# Altium schematic sheet 19-AM64x-08.SchDoc
size B; SheetNumber: 19; SheetTotal: 25
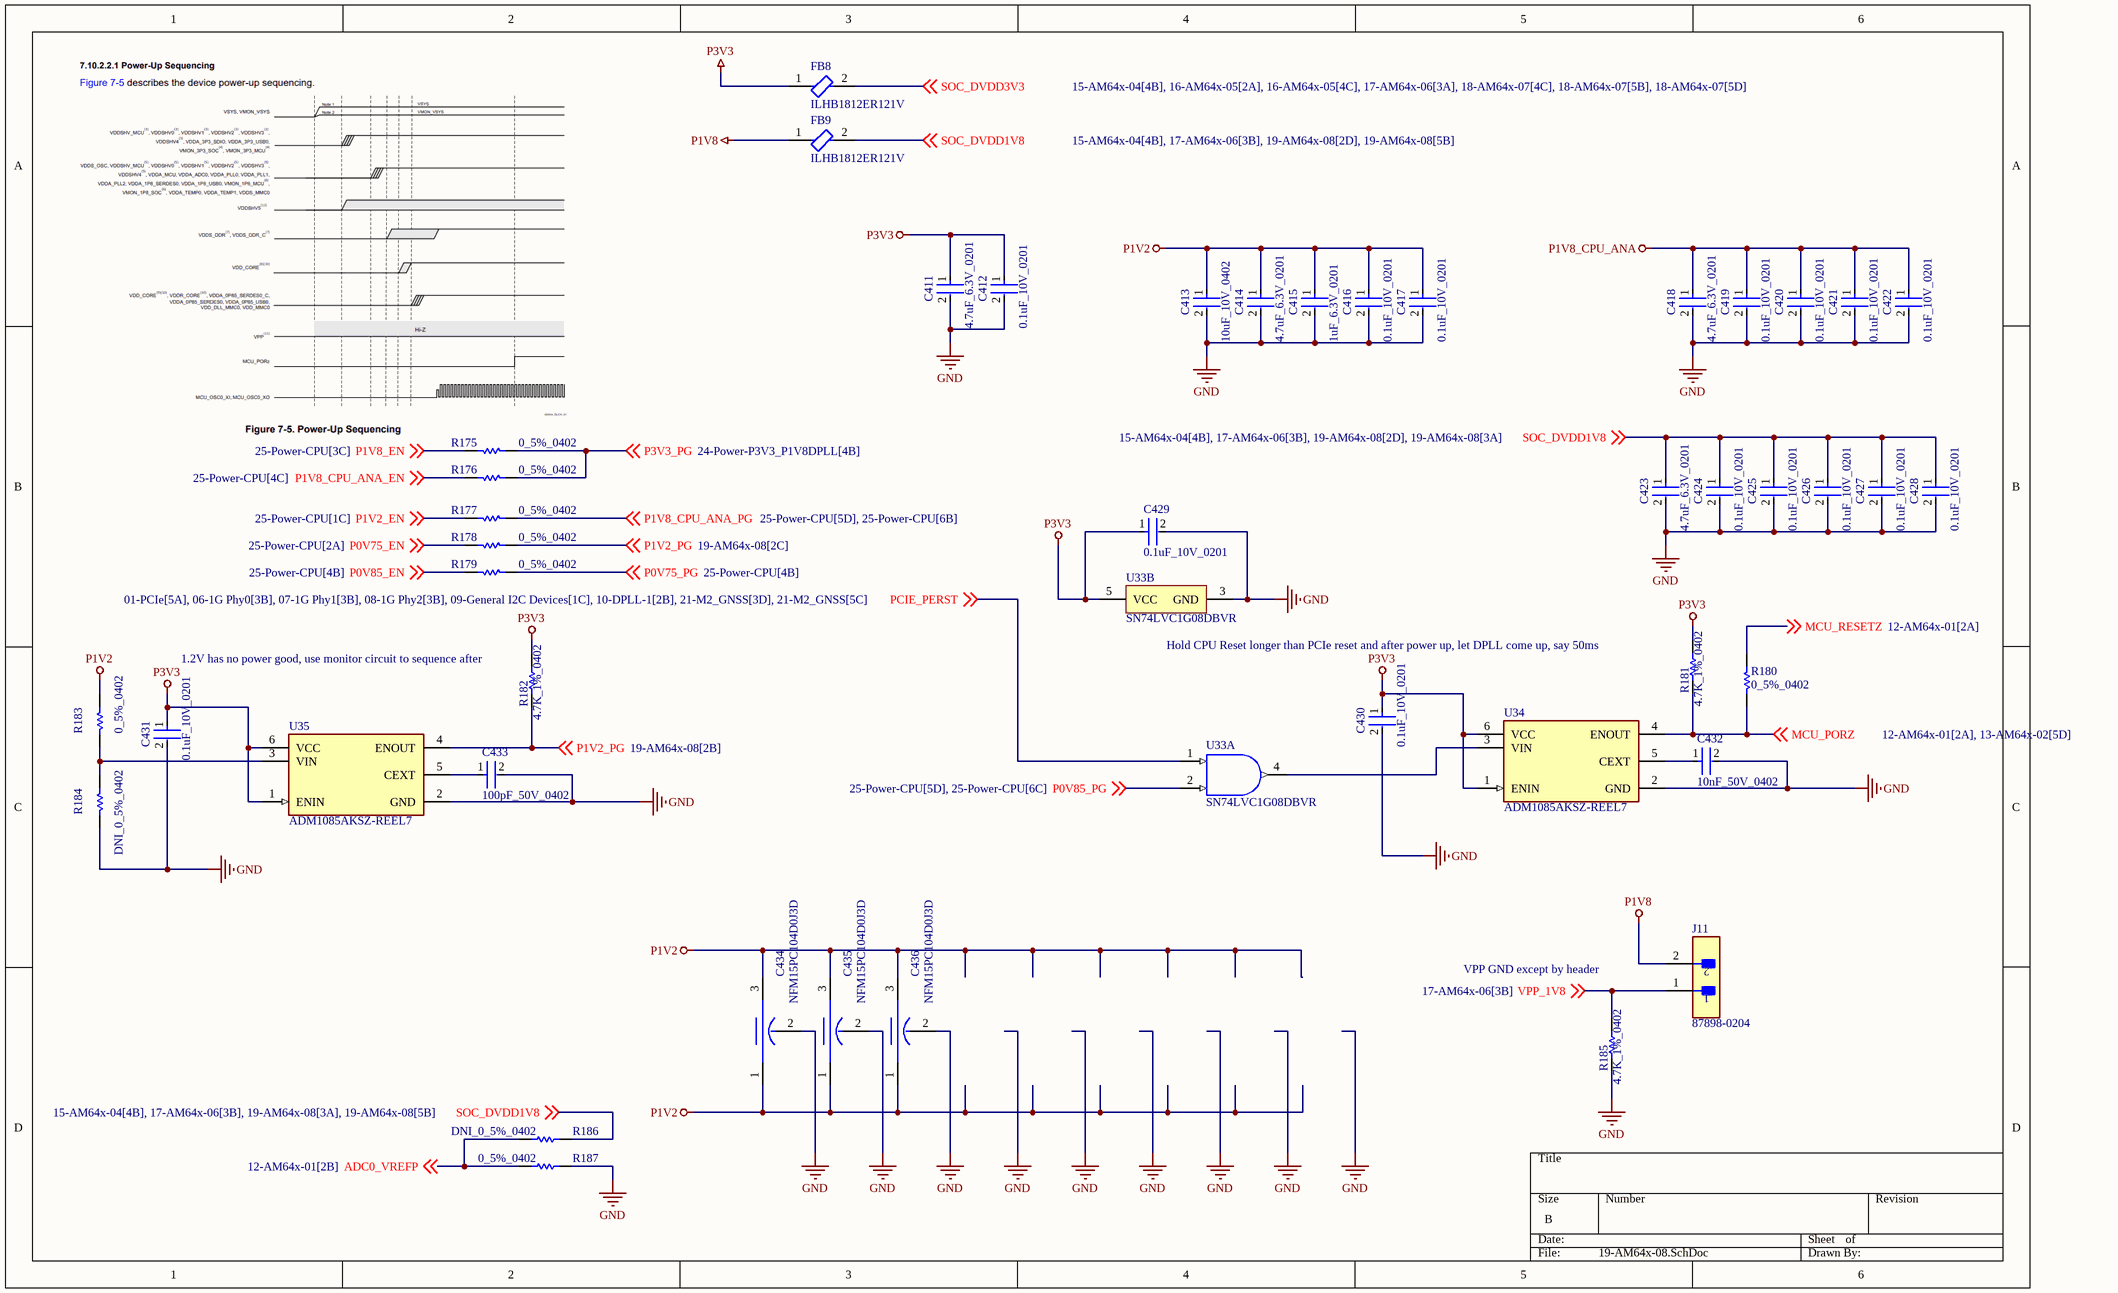
[diagram p0: 19-AM64x-08.SchDoc]

## Parts
C411  4.7uF_6.3V_0201  [FP-GRM035-0_09-IPC_B]
C412  0.1uF_10V_0201  [FP-GRM033-0_03-IPC_C]
C413  10uF_10V_0402  [FP-CL05A106MP5NUNC-MFG]
C414  4.7uF_6.3V_0201  [FP-GRM035-0_09-IPC_B]
C415  1uF_6.3V_0201  [FP-CL03-IPC_B]
C416  0.1uF_10V_0201  [FP-GRM033-0_03-IPC_C]
C417  0.1uF_10V_0201  [FP-GRM033-0_03-IPC_C]
C418  4.7uF_6.3V_0201  [FP-GRM035-0_09-IPC_B]
C419  0.1uF_10V_0201  [FP-GRM033-0_03-IPC_C]
C420  0.1uF_10V_0201  [FP-GRM033-0_03-IPC_C]
C421  0.1uF_10V_0201  [FP-GRM033-0_03-IPC_C]
C422  0.1uF_10V_0201  [FP-GRM033-0_03-IPC_C]
C423  4.7uF_6.3V_0201  [FP-GRM035-0_09-IPC_B]
C424  0.1uF_10V_0201  [FP-GRM033-0_03-IPC_C]
C425  0.1uF_10V_0201  [FP-GRM033-0_03-IPC_C]
C426  0.1uF_10V_0201  [FP-GRM033-0_03-IPC_C]
C427  0.1uF_10V_0201  [FP-GRM033-0_03-IPC_C]
C428  0.1uF_10V_0201  [FP-GRM033-0_03-IPC_C]
C429  0.1uF_10V_0201  [FP-GRM033-0_03-IPC_C]
C430  0.1uF_10V_0201  [FP-GRM033-0_03-IPC_C]
C431  0.1uF_10V_0201  [FP-GRM033-0_03-IPC_C]
C432  10nF_50V_0402  [FP-CL165-IPC_C]
C433  100pF_50V_0402  [FP-C0402-BB-MFG]
C434  NFM15PC104D0J3D  [FP-NFM15-0_1-MFG]
C435  NFM15PC104D0J3D  [FP-NFM15-0_1-MFG]
C436  NFM15PC104D0J3D  [FP-NFM15-0_1-MFG]
FB8  ILHB1812ER121V  [FP-ILHB1812-IPC_A]
FB9  ILHB1812ER121V  [FP-ILHB1812-IPC_A]
J11  87898-0204  [FP-87898-0204-MFG]
R175  0_5%_0402  [RESC1005X40X25LL10T10]
R176  0_5%_0402  [RESC1005X40X25LL10T10]
R177  0_5%_0402  [RESC1005X40X25LL10T10]
R178  0_5%_0402  [RESC1005X40X25LL10T10]
R179  0_5%_0402  [RESC1005X40X25LL10T10]
R180  0_5%_0402  [RESC1005X40X25LL10T10]
R181  4.7K_1%_0402  [RESC1005X40X25NL10T10]
R182  4.7K_1%_0402  [RESC1005X40X25NL10T10]
R183  0_5%_0402  [RESC1005X40X25LL10T10]
R184  DNI_0_5%_0402  [RESC1005X40X25LL10T10]  (no BOM)
R185  4.7K_1%_0402  [RESC1005X40X25NL10T10]
R186  DNI_0_5%_0402  [RESC1005X40X25LL10T10]  (no BOM)
R187  0_5%_0402  [RESC1005X40X25LL10T10]
U33  SN74LVC1G08DBVR  [DBV0005A_M]  (parts A,B of 2)
U34  ADM1085AKSZ-REEL7  [FP-KS-6-IPC_B]
U35  ADM1085AKSZ-REEL7  [FP-KS-6-IPC_B]

## Nets
GND: C411.2 C412.2 C413.2 C414.2 C415.2 C416.2 C417.2 C418.2 C419.2 C420.2 C421.2 C422.2 C423.2 C424.2 C425.2 C426.2 C427.2 C428.2 C429.2 C430.2 C431.2 C432.2 C433.2 C434.2(GND) C435.2(GND) C436.2(GND) R184.2 R185.2 R187.2 U33.3(GND) U34.2(GND) U35.2(GND)
P1V2: C413.1 C414.1 C415.1 C416.1 C417.1 C434.1(Input) C434.3(Output) C435.1(Input) C435.3(Output) C436.1(Input) C436.3(Output) R183.1
P1V8: FB9.1 J11.2
P1V8_CPU_ANA: C418.1 C419.1 C420.1 C421.1 C422.1
P3V3: C411.1 C412.1 C429.1 C430.1 C431.1 FB8.1 R181.1 R182.1 U33.5(VCC) U34.1(ENIN) U34.6(VCC) U35.1(ENIN) U35.6(VCC)
ADC0_VREFP: R186.1 R187.1 ; off-sheet ADC0_VREFP
MCU_PORZ: R180.2 R181.2 U34.4(ENOUT) ; off-sheet MCU_PORZ
MCU_RESETZ: R180.1 ; off-sheet MCU_RESETZ
P0V75_EN: R178.2 ; off-sheet P0V75_EN
P0V75_PG: R179.1 ; off-sheet P0V75_PG
P0V85_EN: R179.2 ; off-sheet P0V85_EN
P0V85_PG: U33.2(B) ; off-sheet P0V85_PG
P1V2_EN: R177.2 ; off-sheet P1V2_EN
P1V2_PG: R178.1 R182.2 U35.4(ENOUT) ; off-sheet P1V2_PG
P1V8_CPU_ANA_EN: R176.2 ; off-sheet P1V8_CPU_ANA_EN
P1V8_CPU_ANA_PG: R177.1 ; off-sheet P1V8_CPU_ANA_PG
P1V8_EN: R175.2 ; off-sheet P1V8_EN
P3V3_PG: R175.1 R176.1 ; off-sheet P3V3_PG
PCIE_PERST: U33.1(A) ; off-sheet PCIE_PERST
SOC_DVDD1V8: C423.1 C424.1 C425.1 C426.1 C427.1 C428.1 FB9.2 R186.2 ; off-sheet SOC_DVDD1V8
SOC_DVDD3V3: FB8.2 ; off-sheet SOC_DVDD3V3
VPP_1V8: J11.1 R185.1 ; off-sheet VPP_1V8
NetC432_1: C432.1 U34.5(CEXT)
NetC433_1: C433.1 U35.5(CEXT)
NetR183_2: R183.2 R184.1 U35.3(VIN)
NetU33_4: U33.4(Y) U34.3(VIN)

## Notes on the sheet
- (near R182) 1.2V has no power good, use monitor circuit to sequence after
- (near R181) Hold CPU Reset longer than PCIe reset and after power up, let DPLL come up, say 50ms
- VPP GND except by header

## Library data of the parts
C411 C414 C418 C423 = CMP-06035-019701-1: Chip Multilayer Ceramic Capacitors for General Purpose, 0201, 4.7uF, X5R, 15%, 20%, 6.3V; Capacitance: 4.7uF; Max Operating Temperature: 85°C; Packaging: Tape and Reel; Voltage Rating: 6.3V; Min Operating Temperature: -55°C; Case/Package: 0201; Voltage Rating (DC): 6.3V; Tolerance: 20%; Length: 0.024inch; Dielectric: X5R; Case Code (Imperial): 0201; Case Code (Metric): 0603; Width: 0.012inch; Mount: Surface Mount; Thickness: 0.022inch
C412 C416 C417 C419-C422 C424-C431 = CMP-2010-01264-2: Chip Multilayer Ceramic Capacitors for General Purpose, 0201, 0.10uF, X5R, 15%, 10%, 10V; Capacitance: 100nF; Mount: Surface Mount; Dielectric: X5R; Width: 0.012inch; Tolerance: 10%; Radiation Hardening: No; Voltage Rating: 10V; REACH SVHC: No SVHC; Height: 0.3mm; Max Operating Temperature: 85°C; Voltage Rating (DC): 10V; Thickness: 0.013inch; Termination: SMD/SMT; Lead Free: Lead Free; Package Quantity: 1; Case/Package: 0201; Min Operating Temperature: -55°C; Weight: 6E-06oz; Length: 0.6mm; Case Code (Imperial): 0201; Depth: 0.3mm; Voltage: 10V; Packaging: Tape and Reel; Case Code (Metric): 0603
C413 = CMP-13271-000002-1: CAP CER 10UF 10V X5R 0402; Manufacturer Part Number: CL05A106MP5NUNC; Manufacturer: Samsung; Temperature Coefficient: 15%; Tolerance: 20%; Material: Ceramic; Octopart: https://octopart.com/cl05a106mp5nunc-samsung-22457395; Voltage Rating: 10V; RoHS: TRUE; Value: 10uF; Height: 0.7mm; Digikey Description: CAP CER 10UF 10V X5R 0402; Automotive: No; Package: CL05A106MP5NUNC; Device Class L1: Passive Components; Capacitance: 10uF; Temperature Range High: +85°C; ComponentLink2Description: Datasheet; Device Class L2: Capacitors; Temperature Characteristic: X5R; Temperature: -55°C to +85°C; ComponentLink2URL: http://www.samsungsem.com/kr/support/product-search/mlcc/__icsFiles/afieldfile/2019/05/10/19-CL05A106MP5NUNC.pdf; Device Class L3: Ceramic Capacitors; Category: Cap; Temperature Range Low: -55°C; Ipc Land Pattern Name: CAPC10050X50; Lead Free: Yes
C415 = CMP-13271-002789-1: Cap Ceramic 1uF 6.3V X5R ±20% Pad SMD 0201 +85°C T/R; Tolerance: 20%; Voltage Rating: 6.3V; Mount: Surface Mount; Min Operating Temperature: -55°C; Package Quantity: 15000; Max Operating Temperature: 85°C; Height: 0.3mm; Packaging: Tape and Reel; Thickness: 0.013inch; Dielectric: X5R; Case/Package: 0201; Case Code (Imperial): 0201; Radiation Hardening: No; Case Code (Metric): 0603; Capacitance: 1uF; Width: 0.012inch; Depth: 0.3mm; Length: 0.6mm
C432 = CMP-13271-000387-1: Cap Ceramic 10nF 50V X7R ±10% SMD 0402 +125°C Paper T/R; Depth: 0.5mm; Length: 1mm; Lead Free: Lead Free; Case Code (Metric): 1005; Width: 0.02inch; Min Operating Temperature: -55°C; Thickness: 0.022inch; Package Quantity: 1; Mount: Surface Mount; Height: 0.5mm; Voltage: 50V; Material: Ceramic; Tolerance: 10%; Case Code (Imperial): 0402; Radiation Hardening: No; Case/Package: 0402; Max Operating Temperature: 125°C; Voltage Rating (DC): 50V; Contact Plating: Tin; Packaging: Tape and Reel; Voltage Rating: 50V; Capacitance: 10nF; Dielectric: X7R
C433 = CMP-2008-03417-2: CAP CER 100PF 50V C0G/NP0 0402; Manufacturer: Kemet; Manufacturer Part Number: C0402C101G5GACTU; Material: Ceramic; Temperature Characteristic: C0G; Tolerance: 0.02; Temperature Coefficient: 15%; Temperature Range High: +125°C; Lead Free: Yes; Capacitance: 100 pF; Value: 100 pF; ComponentLink2URL: https://content.kemet.com/datasheets/KEM_C1002_X7R_SMD.pdf; Automotive: No; Voltage Rating: 50 V; Category: Cap; Device Class L2: Capacitors; ComponentLink2Description: Datasheet; Mouser Description: Multilayer Ceramic Capacitors MLCC - SMD/SMT 50volts 100pF C0G 2%; RoHS: TRUE; Device Class L3: Ceramic Capacitors; Temperature Range Low: -55°C; Octopart: https://octopart.com/c0402c101g5gactu-kemet-16782744; Height: 0.55mm; Ipc Land Pattern Name: CAPC10050X50; Package: C0402-BB; Device Class L1: Passive Components; Temperature: -55°C to +125°C; Digikey Description: CAP CER 100PF 50V C0G/NP0 0402
C434-C436 = CMP-06053-000047-1: CAP FEEDTHRU 0.1UF 20% 6.3V 0402; Capacitance: 100nF; Current Rating: 2A; DC Resistance (DCR): 30mR; REACH SVHC: No SVHC; Voltage Rating (DC): 6.3V; Height: 0.02inch; Length: 0.039inch; Package Quantity: 10000; Mount: Surface Mount; Min Operating Temperature: -55°C; Tolerance: 20%; Case/Package: 0402; Max Operating Temperature: 105°C; Width: 0.02inch; Voltage Rating: 6.3V; Current: 2A; Packaging: Tape and Reel
FB8 FB9 = CMP-00030-39649834-1: ILHB1812ER121V Ferrite Beads Multi-Layer High Current 120Ohm 25% 100MHz 6A 20mOhm DCR 1812 T/R; Series Resistance: 15mΩ; Impedance: 120Ω; Shielding: Shielded; DC Resistance (DCR): 20mΩ; Number of Lines: 1; Width: 3.2004mm; RMS Current (Irms): 6A; Number of Pins: 1812; Case/Package: 1812; Case Code (Metric): 4532; RoHS: Compliant; Schedule B: 8504500000, 8504500000; Military Standard: Not; Max DC Current: 6A; Min Operating Temperature: -55°C; Max Current Rating: 6A; Termination: SMD/SMT; Current Rating: 6A; Max Operating Temperature: 125°C; Tolerance: 25%; Packaging: Tape and Reel; DC Current: 6A; Height: 1.75mm; Case Code (Imperial): 1812; Length: 4.5mm; Core Material: Ferrite; Mount: Surface Mount; Radiation Hardening: No; Test Frequency: 100MHz; NexarPartId: 39649834; Depth: 3.45mm
J11 = CMP-04776-000997-1: CONN BREAKAWAY SMD HDR 2POS; Gender: Male; Current Rating: 3A; Number of Contacts: 2; Pitch: 2.54mm; Voltage Rating: 250V; Housing Material: Nylon; Number of Rows: 1; Contact Mating Length: 5.84mm; Min Operating Temperature: -55°C; Mount: Surface Mount; Contact Gender: Male; Radiation Hardening: No; Orientation: Straight; Termination: SMD/SMT; Number of Positions: 2; RoHS Compliant: Yes; Series: 87898; Packaging: Tray; Max Operating Temperature: 105°C; Contact Plating: Gold; Contact Material: Copper Alloy
R175-R180 R183 R184 R186 R187 = CMP-2002-04569-1: Manufacturer: KOA Speer; Part Number: RK73Z1ETTP
R181 R182 R185 = CMP-2002-05217-1: Manufacturer: Bourns; Part Number: CR0402-FX-4701GLF
U33 = CMP-0859-00053-3: Single 2-Input Positive-AND Gate, DBV0005A, LARGE T&R; Manufacturer: Texas Instruments; Logic: True; ICC @ Nom Voltage(Max)(mA): 0.01; VCC(Min)(V): 1.65; Bits(#): 1; Rating: Catalog; Schmitt Trigger: No; Voltage(Nom)(V): 1.8,2.5,3.3,5; Output Drive (IOL/IOH)(Max)(mA): 32/-32; Gate Type: AND; tpd @ Nom Voltage(Max)(ns): 4.5,6,4,5; VCC(Max)(V): 5.5; Output Type: CMOS; F @ Nom Voltage(Max)(Mhz): 150; Input Type: CMOS/TTL; Technology Family: LVC; Sub-Family: AND Gate; PackageReference: DBV0005A; Generic Part Number: SN74LVC1G08; Operating Temperature Range(C): -40 to 125,-40 to 85; 3-State Output: No; DatasheetVersion: SCES217Y
U34 U35 = CMP-09140-000008-1: IC SUPERVISOR 1 CHANNEL SC70-6; Min Reset Threshold Voltage: 560mV; Operating Supply Voltage: 125V; Operating Supply Current: 10uA; Reset: Active High; Max Reset Threshold Voltage: 640mV; Watchdog Timer: No; Min Supply Voltage: 2.25V; Number of Voltages Monitored: 1; Max Supply Current: 15uA; Threshold Voltage: 600mV; Max Supply Voltage: 3.6V; Nominal Supply Current: 10uA; Mount: Surface Mount; Width: 1.35mm; Max Operating Temperature: 125°C; Lead Free: Contains Lead; Package Quantity: 3000; Undervoltage Threshold: 560mV; Type: Sequencer; Packaging: Tape and Reel; Min Operating Temperature: -40°C; Radiation Hardening: No; REACH SVHC: No SVHC; Overvoltage Threshold: 640mV; Number of Pins: 6; Case/Package: SC; Length: 2.2mm; Height: 1mm; Number of Monitored Inputs: 1